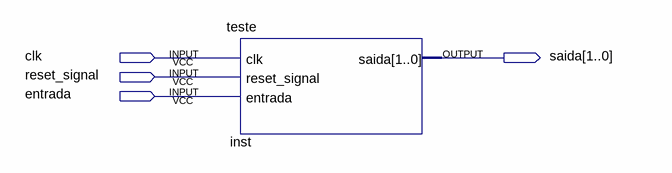
[diagram p0: schematic sheet]
// Quartus schematic Block2.bdf as structural Verilog: 1 symbols, 4 pins
module Block2 (
  input  clk,
  input  reset_signal,
  input  entrada,
  output [1:0] saida
);

  teste inst (.clk(clk), .reset_signal(reset_signal), .entrada(entrada), .saida(saida));
endmodule
